# Altium schematic sheet LEDs.SchDoc
size A; SheetNumber: 4; SheetTotal: 5
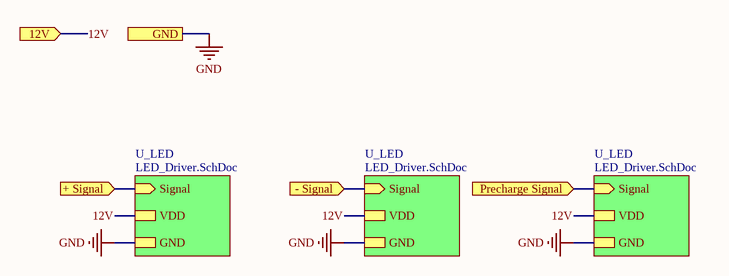
[diagram p0: LEDs.SchDoc]

## Sub-sheets
U_LED = LED_Driver.SchDoc: Signal (in), VDD, GND
U_LED = LED_Driver.SchDoc: Signal (in), VDD, GND
U_LED = LED_Driver.SchDoc: Signal (in), VDD, GND

## Ports
12V (in), + Signal (in), - Signal (in), GND, Precharge Signal (in)

## Nets
GND: port GND, sheet U_LED/GND, sheet U_LED/GND, sheet U_LED/GND
12V: port 12V, sheet U_LED/VDD, sheet U_LED/VDD, sheet U_LED/VDD
+ Signal: port + Signal, sheet U_LED/Signal
- Signal: port - Signal, sheet U_LED/Signal
Precharge Signal: port Precharge Signal, sheet U_LED/Signal